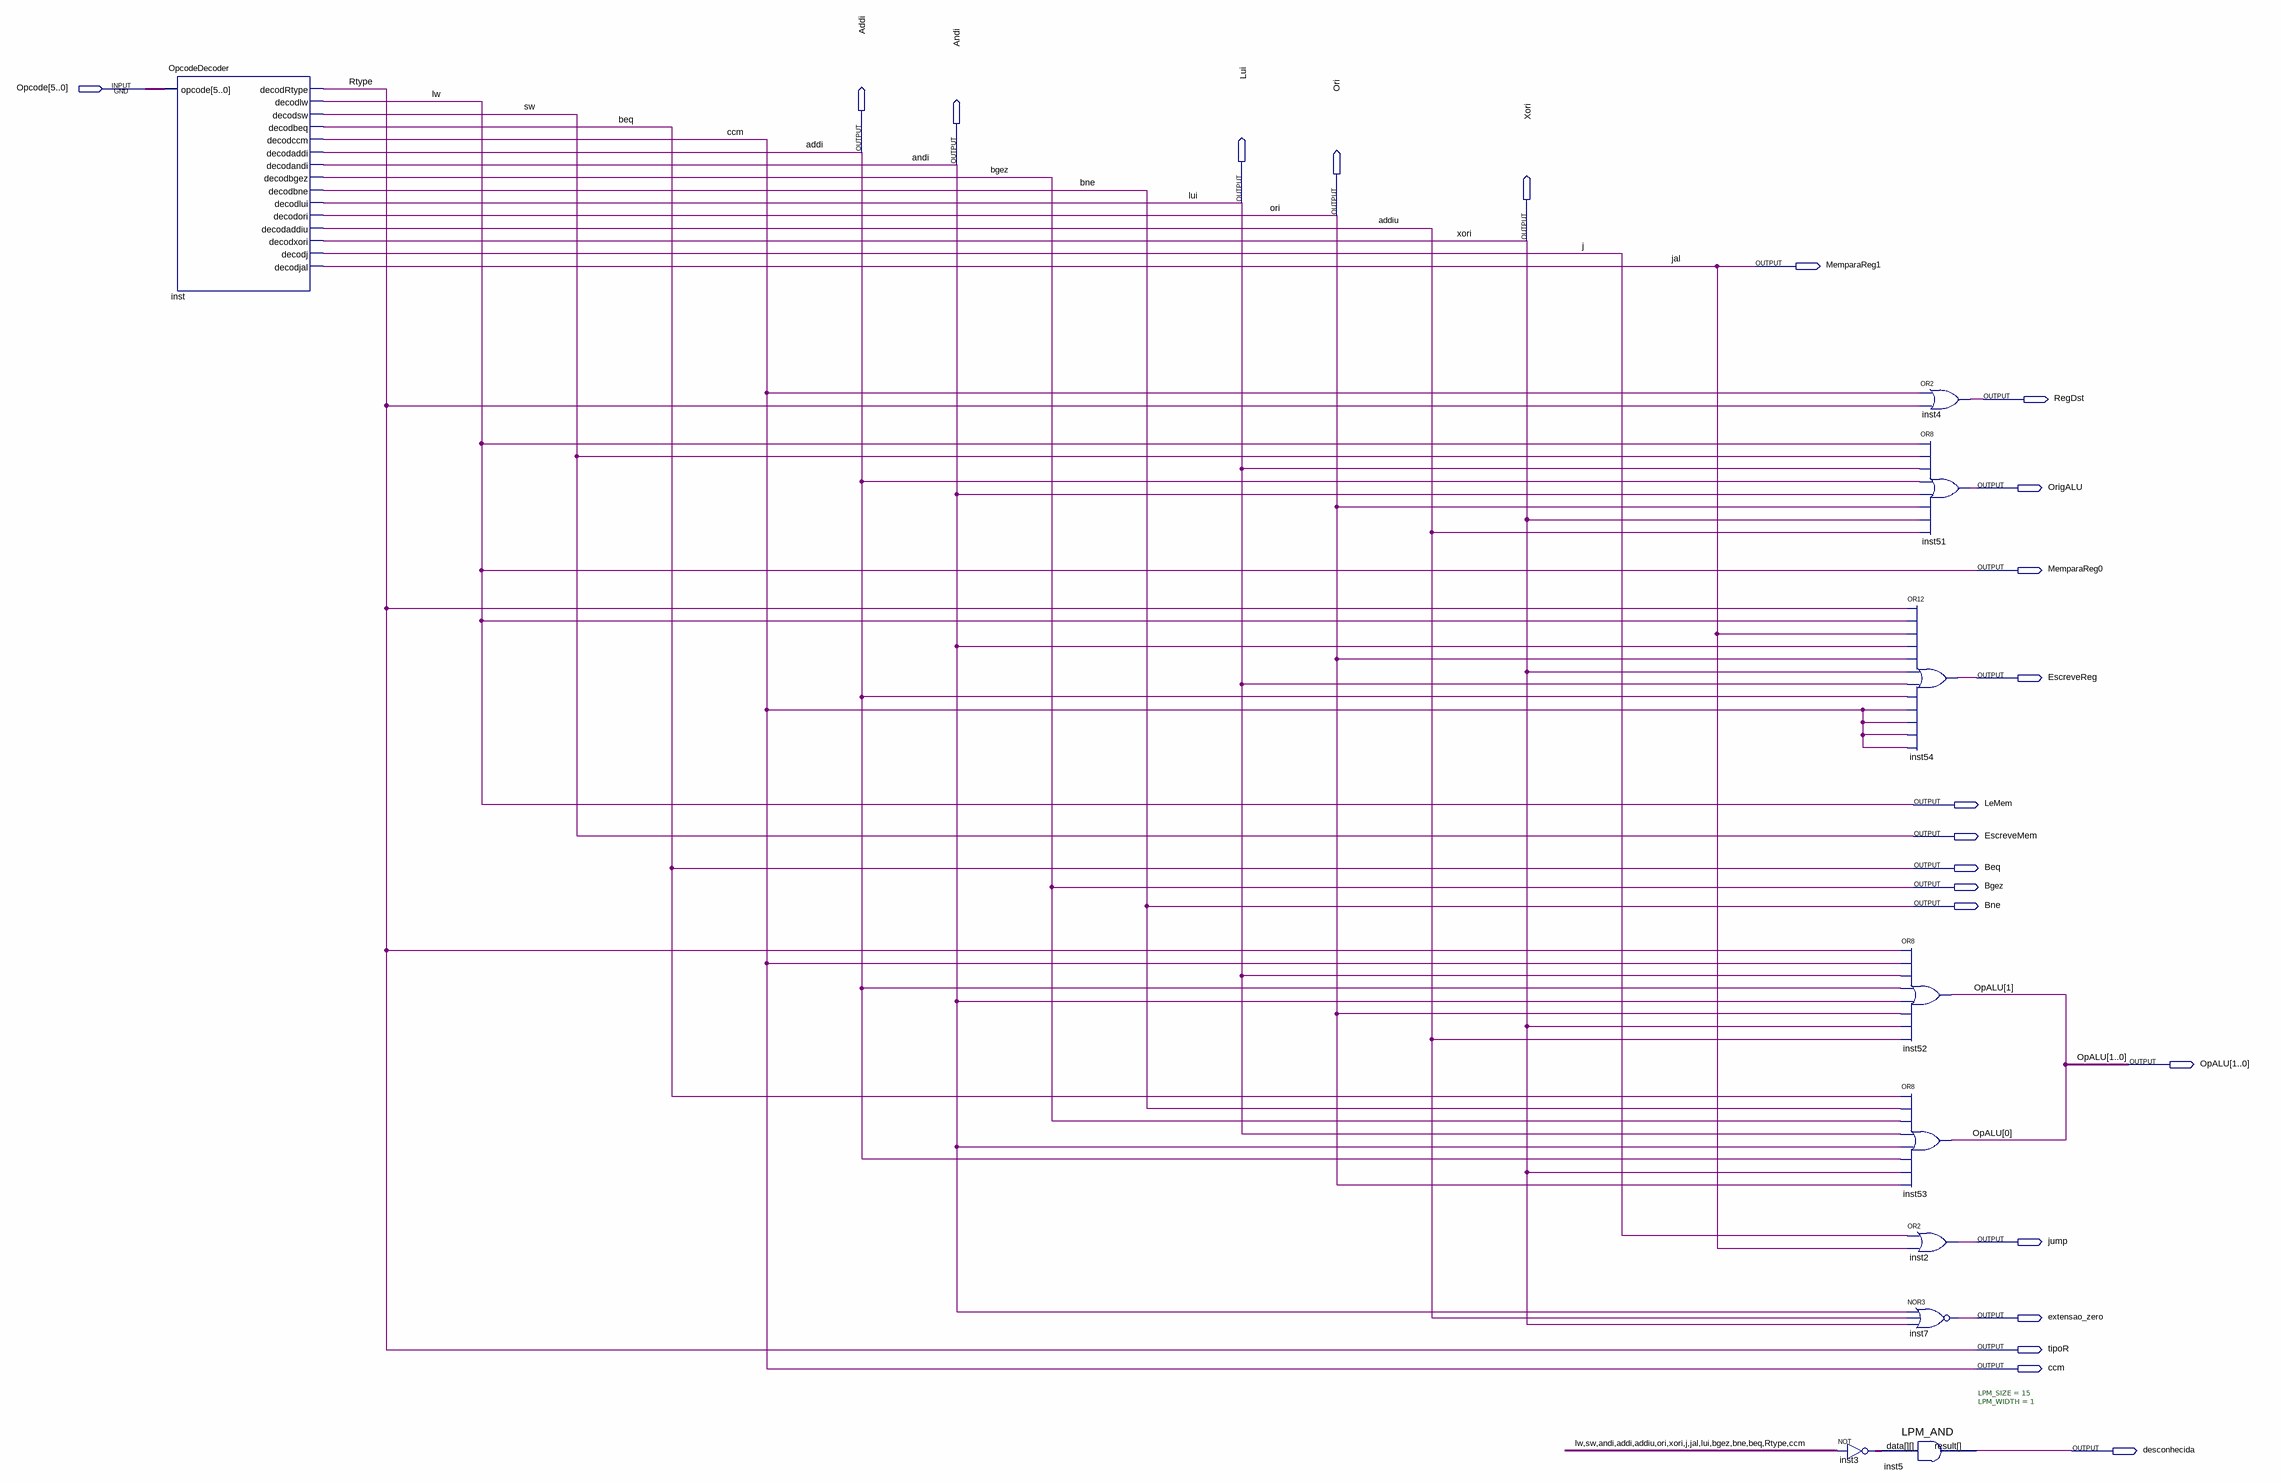
[diagram p0: schematic sheet]
// Quartus schematic Controle.bdf as structural Verilog: 10 symbols, 22 pins
module Controle (
  input  [5:0] Opcode,
  output Addi,
  output Andi,
  output Lui,
  output Ori,
  output Xori,
  output MemparaReg1,
  output RegDst,
  output OrigALU,
  output MemparaReg0,
  output EscreveReg,
  output LeMem,
  output EscreveMem,
  output Beq,
  output Bgez,
  output Bne,
  output [1:0] OpALU,
  output jump,
  output extensao_zero,
  output tipoR,
  output ccm,
  output desconhecida
);

  wire addiu, j;
  wire [14:0] inst3_out;

  OpcodeDecoder inst (
    .opcode(Opcode), .decodRtype(tipoR), .decodlw(LeMem), .decodsw(EscreveMem), .decodbeq(Beq),
    .decodccm(ccm), .decodaddi(Addi), .decodandi(Andi), .decodbgez(Bgez), .decodbne(Bne), .decodlui(Lui),
    .decodori(Ori), .decodaddiu(addiu), .decodxori(Xori), .decodj(j), .decodjal(MemparaReg1));
  assign inst3_out = ~{LeMem, EscreveMem, Andi, Addi, addiu, Ori, Xori, j, MemparaReg1, Lui, Bgez, Bne, Beq, tipoR, ccm};  // NOT inst3, 15 bits wide
  LPM_AND #(.LPM_SIZE(15), .LPM_WIDTH(1)) inst5 (.data(inst3_out), .result(desconhecida));
  or inst4 (RegDst, ccm, tipoR);
  or inst51 (OrigALU, LeMem, EscreveMem, Lui, Addi, Andi, Ori, Xori, addiu);
  or inst54 (EscreveReg, tipoR, LeMem, MemparaReg1, Andi, Ori, Xori, Lui, Addi, ccm, ccm, ccm, ccm);
  or inst52 (OpALU[1], tipoR, ccm, Lui, Addi, Andi, Ori, Xori, addiu);
  or inst53 (OpALU[0], Beq, Bne, Bgez, Lui, Andi, Addi, Xori, Ori);
  or inst2 (jump, j, MemparaReg1);
  nor inst7 (extensao_zero, Andi, addiu, Xori);

  assign MemparaReg0 = LeMem;

  // Other names for the same wires on the sheet: sw = EscreveMem; jal = MemparaReg1; lw = LeMem; Rtype = tipoR
endmodule
